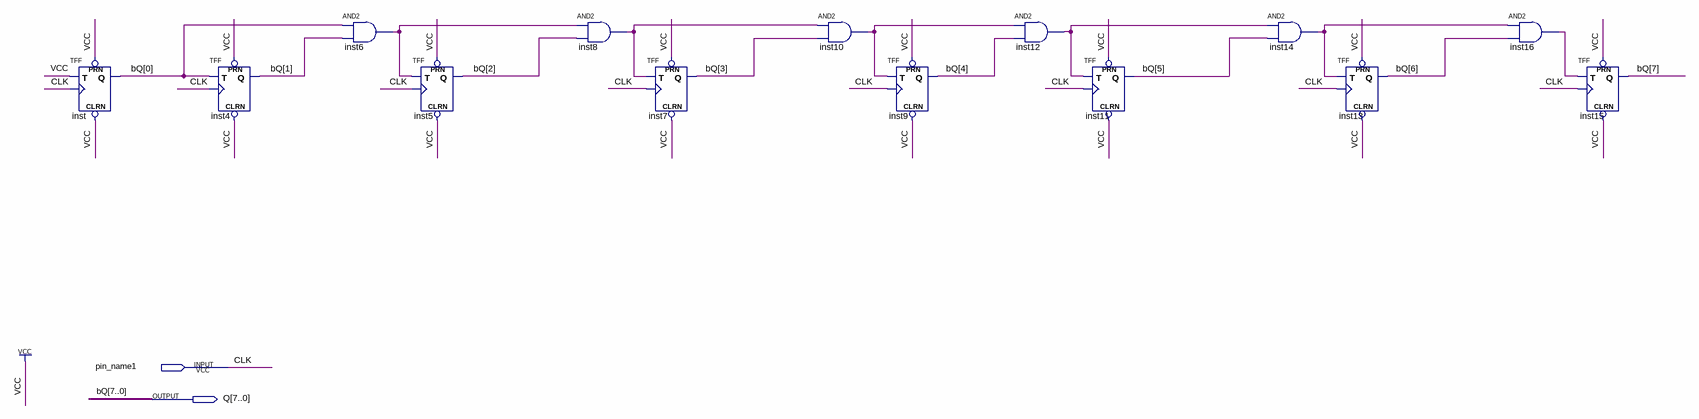
[diagram p0: schematic sheet]
// Quartus schematic Contador.bdf as structural Verilog: 14 symbols, 2 pins
module Contador (
  input  pin_name1,
  output [7:0] Q
);

  wire inst6_out, inst8_out, inst10_out, inst12_out, inst14_out, inst16_out;

  TFF inst (.PRN(1'b1), .CLRN(1'b1), .T(1'b1), .CLK(pin_name1), .Q(Q[0]));
  TFF inst4 (.PRN(1'b1), .CLRN(1'b1), .T(Q[0]), .CLK(pin_name1), .Q(Q[1]));
  and inst6 (inst6_out, Q[0], Q[1]);
  TFF inst5 (.PRN(1'b1), .CLRN(1'b1), .T(inst6_out), .CLK(pin_name1), .Q(Q[2]));
  and inst8 (inst8_out, inst6_out, Q[2]);
  TFF inst7 (.PRN(1'b1), .CLRN(1'b1), .T(inst8_out), .CLK(pin_name1), .Q(Q[3]));
  and inst10 (inst10_out, inst8_out, Q[3]);
  TFF inst9 (.PRN(1'b1), .CLRN(1'b1), .T(inst10_out), .CLK(pin_name1), .Q(Q[4]));
  and inst12 (inst12_out, inst10_out, Q[4]);
  TFF inst11 (.PRN(1'b1), .CLRN(1'b1), .T(inst12_out), .CLK(pin_name1), .Q(Q[5]));
  and inst14 (inst14_out, inst12_out, Q[5]);
  TFF inst13 (.PRN(1'b1), .CLRN(1'b1), .T(inst14_out), .CLK(pin_name1), .Q(Q[6]));
  and inst16 (inst16_out, inst14_out, Q[6]);
  TFF inst15 (.PRN(1'b1), .CLRN(1'b1), .T(inst16_out), .CLK(pin_name1), .Q(Q[7]));

  // Other names for the same wires on the sheet: bQ[7:0] = Q; CLK = pin_name1
endmodule
